# Altium schematic sheet led.SchDoc
size A
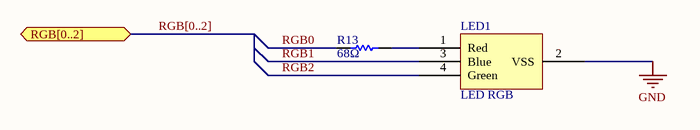
[diagram p0: led.SchDoc]

## Parts
LED1  LED RGB  [Led RGB]
R13  value 68Ω  [RESISTANCE]  (hidden comment: Res1)

## Ports
RGB[0..2] (bidir)

## Nets
GND: LED1.2(VSS)
RGB0: R13.1
RGB1: LED1.3(Blue)
RGB2: LED1.4(Green)
NetLED1_1: LED1.1(Red) R13.2

## Buses and harness runs
bus RGB[0..2] = port RGB[0..2]

## Library data of the parts
LED1 = LED RGB: Fabricant: MULTICOMP; Ref fabricant: 703-1028; Fournisseur: Farnell; Ref fournisseur: 2112143
R13 = Res1: Resistor; Published: 8-Jun-2000; LatestRevisionDate: 17-Jul-2002; LatestRevisionNote: Re-released for DXP Platform.; PackageReference: AXIAL-0.3; Publisher: Altium Limited; PackageDescription: Axial Device, Thru-Hole; 2 Leads; 0.3 in Pin Spacing